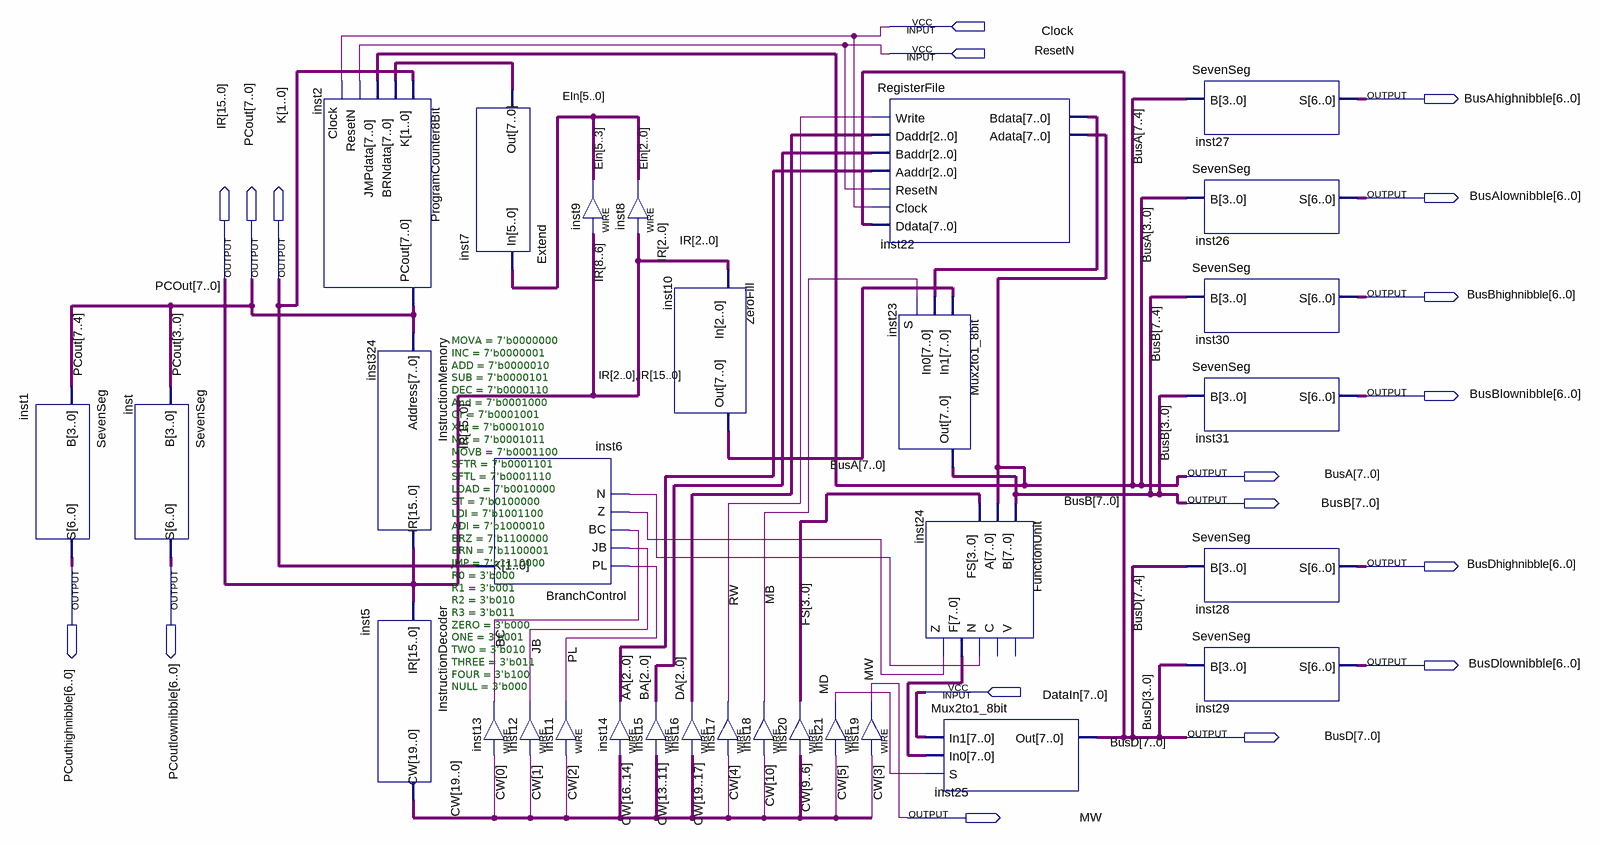
[diagram p0: schematic sheet]
// Quartus schematic SingleCycleComputer.bdf as structural Verilog: 31 symbols, 18 pins
module SingleCycleComputer (
  input  Clock,
  input  ResetN,
  input  [7:0] DataIn,
  output [6:0] BusAhighnibble,
  output [6:0] BusAlownibble,
  output [15:0] IR,
  output [7:0] PCout,
  output [1:0] K,
  output [6:0] BusBhighnibble,
  output [6:0] BusBlownibble,
  output [7:0] BusA,
  output [7:0] BusB,
  output [6:0] PCouthighnibble,
  output [6:0] PCoutlownibble,
  output [6:0] BusDhighnibble,
  output [6:0] BusDlownibble,
  output [7:0] BusD,
  output MW
);

  wire BC, inst24_n, inst24_z, JB, MB, MD, PL, RW;
  wire [2:0] AA, BA, DA;
  wire [3:0] FS;
  wire [5:0] EIn;
  wire [7:0] inst7_out, inst10_out, inst22_bdata, inst24_f;
  wire [19:0] CW;

  SevenSeg inst1 (.B(PCout[7:4]), .S(PCouthighnibble));
  SevenSeg inst (.B(PCout[3:0]), .S(PCoutlownibble));
  ProgramCounter8Bit inst2 (.K(K), .BRNdata(inst7_out), .JMPdata(BusA), .ResetN(ResetN), .Clock(Clock), .PCout(PCout));
  InstructionMemory #(.MOVA(7'b0000000), .INC(7'b0000001), .ADD(7'b0000010), .SUB(7'b0000101), .DEC(7'b0000110), .And(7'b0001000), .Or(7'b0001001), .Xor(7'b0001010), .Not(7'b0001011), .MOVB(7'b0001100), .SFTR(7'b0001101), .SFTL(7'b0001110), .LOAD(7'b0010000), .ST(7'b0100000), .LDI(7'b1001100), .ADI(7'b1000010), .BRZ(7'b1100000), .BRN(7'b1100001), .JMP(7'b1110000), .R0(3'b000), .R1(3'b001), .R2(3'b010), .R3(3'b011), .ZERO(3'b000), .ONE(3'b001), .TWO(3'b010), .THREE(3'b011), .FOUR(3'b100), .NULL(3'b000)) inst324 (
    .Address(PCout), .IR(IR));
  InstructionDecoder inst5 (.IR(IR), .CW(CW));
  Extend inst7 (.In(EIn), .Out(inst7_out));
  BranchControl inst6 (.PL(PL), .JB(JB), .BC(BC), .Z(inst24_z), .N(inst24_n), .K(K));
  assign JB = CW[1];  // WIRE inst12
  assign BC = CW[0];  // WIRE inst13
  assign EIn[5:3] = IR[8:6];  // WIRE inst9
  assign PL = CW[2];  // WIRE inst11
  assign EIn[2:0] = IR[2:0];  // WIRE inst8
  ZeroFill inst10 (.In(IR[2:0]), .Out(inst10_out));
  assign AA = CW[16:14];  // WIRE inst14
  assign BA = CW[13:11];  // WIRE inst15
  assign DA = CW[19:17];  // WIRE inst16
  assign RW = CW[4];  // WIRE inst17
  assign MB = CW[10];  // WIRE inst18
  assign FS = CW[9:6];  // WIRE inst20
  RegisterFile inst22 (
    .Write(RW), .Daddr(DA), .Baddr(BA), .Aaddr(AA), .ResetN(ResetN), .Clock(Clock), .Ddata(BusD),
    .Bdata(inst22_bdata), .Adata(BusA));
  Mux2to1_8bit inst23 (.In1(inst10_out), .In0(inst22_bdata), .S(MB), .Out(BusB));
  assign MW = CW[3];  // WIRE inst19
  assign MD = CW[5];  // WIRE inst21
  FunctionUnit inst24 (.B(BusB), .A(BusA), .FS(FS), .N(inst24_n), .F(inst24_f), .Z(inst24_z));  // open: V, C
  Mux2to1_8bit inst25 (.In1(DataIn), .In0(inst24_f), .S(MD), .Out(BusD));
  SevenSeg inst27 (.B(BusA[7:4]), .S(BusAhighnibble));
  SevenSeg inst26 (.B(BusA[3:0]), .S(BusAlownibble));
  SevenSeg inst30 (.B(BusB[7:4]), .S(BusBhighnibble));
  SevenSeg inst31 (.B(BusB[3:0]), .S(BusBlownibble));
  SevenSeg inst28 (.B(BusD[7:4]), .S(BusDhighnibble));
  SevenSeg inst29 (.B(BusD[3:0]), .S(BusDlownibble));
endmodule
